# EAGLE design EAGLEPCBFINAL (EAGLE 9.6.2)
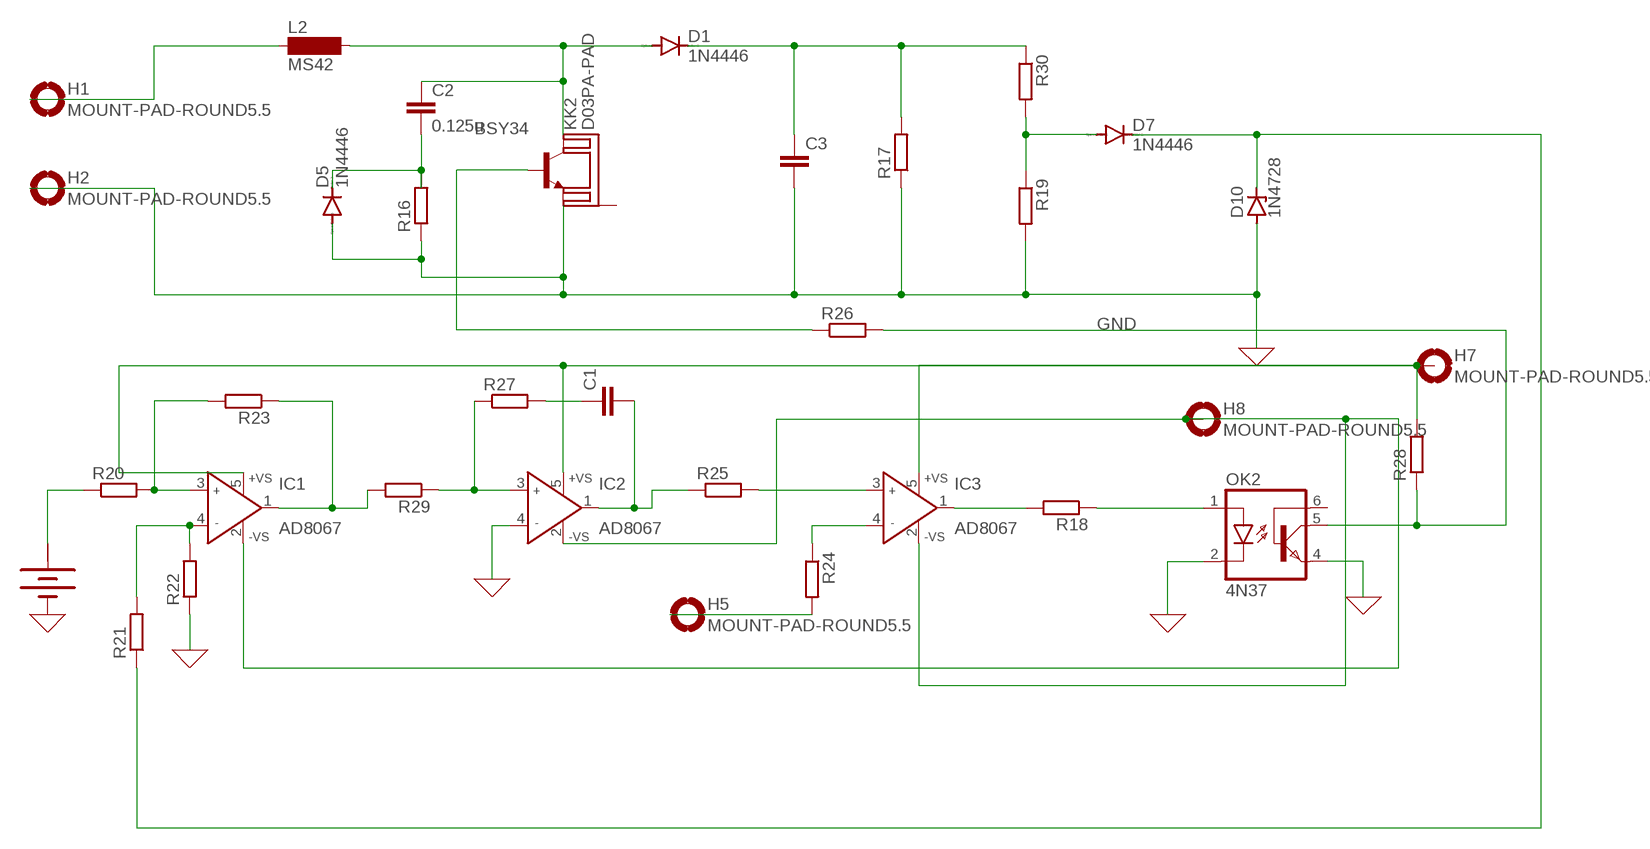
[diagram p0: schematic, sheet 1]

## Parts
BAT1  BATTERY  [BATTERY]
C1  C2.5/2  [C2.5-2]
C2  0.125u  C5/3.5  [C5B3.5]
C3  C7.5/3  [C7.5B3]
D1  1N4446  [DO35-10]
D5  1N4446  [DO35-10]
D7  1N4446  [DO35-10]
D10  1N4728  [DO41Z10]
H1  MOUNT-PAD-ROUND5.5  [5,5-PAD]
H2  MOUNT-PAD-ROUND5.5  [5,5-PAD]
H5  MOUNT-PAD-ROUND5.5  [5,5-PAD]
H7  MOUNT-PAD-ROUND5.5  [5,5-PAD]
H8  MOUNT-PAD-ROUND5.5  [5,5-PAD]
IC1  AD8067  [SOT23-5]
IC2  AD8067  [SOT23-5]
IC3  AD8067  [SOT23-5]
KK2  D03PA-PAD  [D03PA-PAD]
L2  MS42  [MS42]
OK2  4N37  [DIL06]
R16  R-EU_0204/2V  [0204V]
R17  R-EU_0204/2V  [0204V]
R18  R-EU_0204/5  [0204/5]
R19  R-EU_0207/10  [0207/10]
R20  R-EU_0207/10  [0207/10]
R21  R-EU_0207/10  [0207/10]
R22  R-EU_0207/10  [0207/10]
R23  R-EU_0207/10  [0207/10]
R24  R-EU_0207/10  [0207/10]
R25  R-EU_0207/10  [0207/10]
R26  R-EU_0207/10  [0207/10]
R27  R-EU_0309/12  [0309/12]
R28  R-EU_0411/15  [0411/15]
R29  R-EU_0411/15  [0411/15]
R30  R-EU_0922/22  [0922/22]
T1  BSY34  [TO39]

## Nets
0: BAT1.- C3.2 D5.A D10.A H2.B5,5(MOUNT) IC2.4(IN-) OK2.2(C) OK2.4(EMI) R16.1 R17.1 R19.2 R22.1 T1.1(E) ; supply symbol labelled GND
N$1: H1.B5,5(MOUNT) L2.1
N$2: C2.1 D1.A L2.2 T1.3(C)
N$3: C3.1 D1.C R17.2 R30.1
N$4: D7.A R19.1 R30.2
N$5: C2.2 D5.C R16.2
N$6: H8.B5,5(MOUNT) IC1.2(-VS) IC2.2(-VS) IC3.2(-VS)
N$7: D7.C D10.C R21.1
N$8: BAT1.+ R20.1
N$9: IC1.3(IN+) R20.2 R23.2
N$10: IC1.4(IN-) R21.2 R22.2
N$11: IC1.1(OUT) R23.1 R29.2
N$12: IC2.3(IN+) R27.1 R29.1
N$13: C1.1 R27.2
N$14: C1.2 IC2.1(OUT) R25.1
N$15: IC3.3(IN+) R25.2
N$16: IC3.4(IN-) R24.1
N$17: IC3.1(OUT) R18.2
N$18: OK2.1(A) R18.1
N$19: OK2.5(COL) R26.2 R28.1
N$20: H7.B5,5(MOUNT) IC1.5(+VS) IC2.5(+VS) IC3.5(+VS) R28.2
N$21: R26.1 T1.2(B)
N$23: H5.B5,5(MOUNT) R24.2
Unconnected: KK2.B(K) OK2.6(BAS)

## Notes on the sheet
- GND

## Power pins joined to a net without a drawn wire
+: BAT1.+@1(+)

## Library data of the parts
BAT1 = special:BATTERY: BATTERY
C1-C3 = capacitor-wima:C: CAPACITOR naming: grid - package width
D1 D5 D7 = diode:1N4446: DIODE high speed (Philips)
D10 = diode:1N4728: Z DIODE 3.3 V, 1W, 5 percent
H1 H2 H5 H7 H8 = holes:MOUNT-PAD-ROUND: MOUNTING PAD, round
IC1-IC3 = analog-devices:AD8067: High Gain Bandwidth, Precision Fast FET(TM) Op Amp Source: http://www.analog.com/UploadedFiles/Data_Sheets/346131962AD8067_a.pdf; MF: ALTERA CORPORATION; MPN: AD8067ARTZ-REEL7; OC_FARNELL: 1464848; OC_NEWARK: 59K6326
KK2 = heatsink:D03PA-PAD: HEATSINK distributor Schukat
L2 = inductor-neosid:MS42: INDUCTOR SMD inductor; OC_FARNELL: unknown; OC_NEWARK: unknown
OK2 = optocoupler:4N37: OPTO COUPLER Source: http://www.fairchildsemi.com/pf/4N/4N35-M.html; MF: FAIRCHILD SEMICONDUCTOR; MPN: 4N37; OC_FARNELL: 1612456; OC_NEWARK: 72K9948
R16-R30 = rcl:R-EU_: RESISTOR, European symbol; SPICEPREFIX: R
T1 = transistor:BSY34: NPN TRANSISTOR

## Board
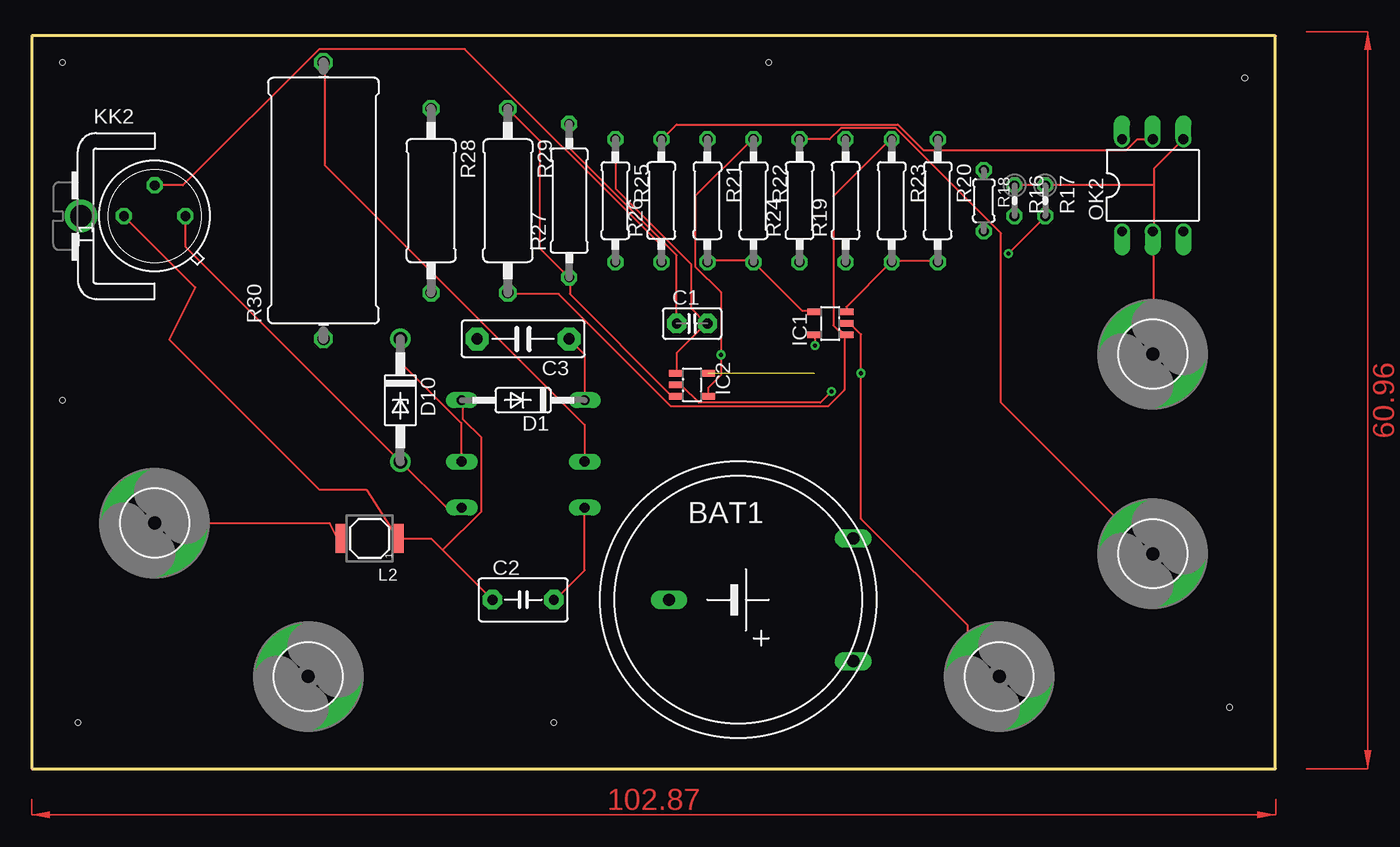
[diagram p1: board, top side]
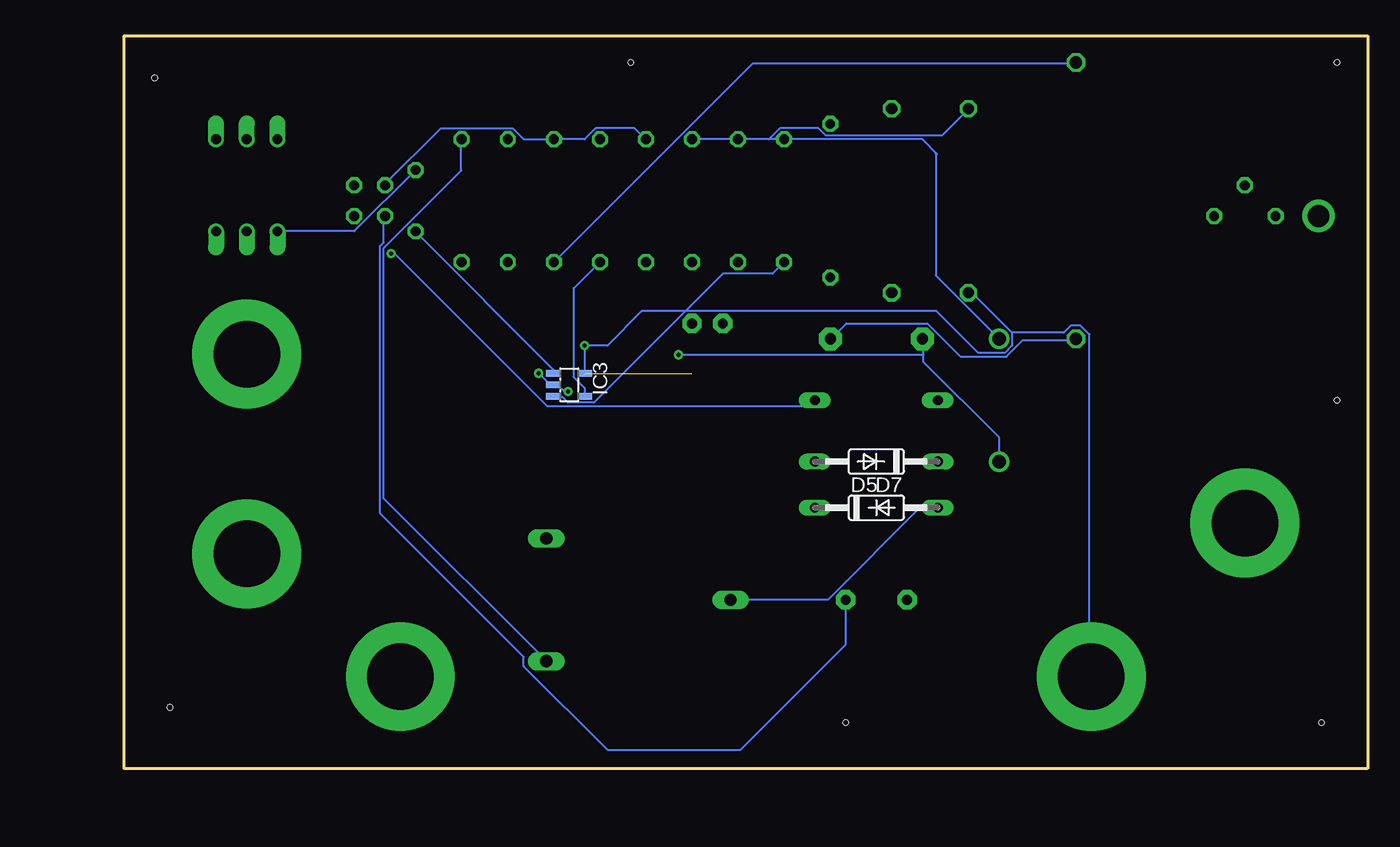
[diagram p2: board, bottom side, seen from below]

Size 102.85 x 60.63 mm. Coordinates in mm from the lower left corner, seen from the top.
Outline: 0,0 102.85,0 102.85,60.63 0,60.63 0,0
Copper layers (1*16): Top 0.035mm / dielectric 1.5mm / Bottom 0.035mm
Design rules "default": minimum track width 6mil, minimum drill 0.35mm, track to track 6mil, track to pad 6mil, pad to pad 6mil, via to via 6mil, smd to smd 6mil, copper to edge 40mil, drill to drill 6mil, minimum pad ring 10mil, minimum via ring 8mil, stop-mask expansion 4mil, vias tented up to drill 0mil, thermal gap 10mil
Holes 0.46 mm at 2.54,58.42 3.81,3.81 43.18,3.81 99.06,5.08 60.96,58.42 100.33,57.15 2.54,30.48

### Footprints (pad centres in the part's own frame; a part is rotated, then mirrored left to right if it is on the bottom)
BATTERY = drill 1.016 long: + 9.525,-5.08; +@1 9.525,5.08; - -5.715,0
C2.5-2 = drill 0.813 pad 1.6 octagon: 1 -1.27,0; 2 1.27,0
C5B3.5 = drill 0.813 pad 1.6 octagon: 1 -2.54,0; 2 2.54,0
C7.5B3 = drill 0.914 pad 1.905 octagon: 1 -3.81,0; 2 3.81,0
DO35-10 = drill 0.813 long: A 5.08,0; C -5.08,0
DO41Z10 = drill 1.118: A 5.08,0; C -5.08,0
5,5-PAD = drill 5.5 pad 9: B5,5 0,0
SOT23-5 = smd 0.55 x 1.2: 1 -0.95,-1.3; 2 0,-1.3; 3 0.95,-1.3; 4 0.95,1.3; 5 -0.95,1.3
D03PA-PAD = drill 1.803 pad 2.54: B 0,-1.016
MS42 = smd 2.4 x 1: 1 0,2.3; 2 0,-2.3
DIL06 = drill 0.813 offset: 1 -2.54,-3.81; 2 0,-3.81; 3 2.54,-3.81; 4 2.54,3.81; 5 0,3.81; 6 -2.54,3.81
0204V = drill 0.813 octagon: 1 -1.27,0; 2 1.27,0
0204/5 = drill 0.813 octagon: 1 -2.54,0; 2 2.54,0
0207/10 = drill 0.813 octagon: 1 -5.08,0; 2 5.08,0
0309/12 = drill 0.813 octagon: 1 -6.35,0; 2 6.35,0
0411/15 = drill 0.914 octagon: 1 -7.62,0; 2 7.62,0
0922/22 = drill 1.016 octagon: 1 -11.43,0; 2 11.43,0
TO39 = drill 0.813 octagon: 1 0,-2.54; 2 2.54,0; 3 0,2.54

### Placement (x,y rotation side)
BAT1  58.42,13.97 0 top
C1  54.61,36.83 0 top
C2  40.64,13.97 0 top
C3  40.64,35.56 180 top
D1  40.64,30.48 180 top
D5  40.64,21.59 0 bottom
D7  40.64,25.4 180 bottom
D10  30.48,30.48 270 top
H1  10.16,20.32 0 top
H2  92.71,34.29 0 top
H5  92.71,17.78 0 top
H7  22.86,7.62 0 top
H8  80.01,7.62 0 top
IC1  66.04,36.83 90 top
IC2  54.61,31.75 270 top
IC3  66.04,31.75 270 bottom
KK2  5.08,45.72 270 top
L2  27.94,19.05 90 top
OK2  92.71,48.26 0 top
R16  81.28,46.99 270 top
R17  83.82,46.99 270 top
R18  78.74,46.99 270 top
R19  67.31,46.99 90 top
R20  74.93,46.99 270 top
R21  55.88,46.99 270 top
R22  59.69,46.99 270 top
R23  71.12,46.99 270 top
R24  63.5,46.99 90 top
R25  48.26,46.99 270 top
R26  52.07,46.99 90 top
R27  44.45,46.99 90 top
R28  33.02,46.99 270 top
R29  39.37,46.99 270 top
R30  24.13,46.99 90 top
T1  10.16,45.72 90 top

### Tracks (layer width: path | path; a pad name or v marks a point on that pad's centre or on a via)
0  (via drill 0.35)
  Top 0.152: D5.A 34.29,21.59 D10.A 12.7,43.18 T1.1 | IC2.4 55.93,30.89 55.93,31.5 57,32.56 v57,34.24 57,39.42 54.86,41.55 54.86,47.35 59.59,52.07 R22.1 | R16.1 R17.1 92.81,48.26 | 92.81,48.26 92.81,49.63 OK2.4 | 92.81,48.26 92.81,44.45 | 92.81,44.45 92.81,34.39 H2.B5,5 | 92.81,44.45 OK2.2
  Bottom 0.152: BAT1.- 44.65,13.97 37.03,21.59 D5.A | 36.73,34.24 36.73,33.63 30.48,27.38 D10.A | 36.73,34.24 36.73,35.46 C3.2 | R22.1 59.74,52.07 60.65,52.98 63.86,52.98 64.77,52.07 R19.2 69.8,52.07 70.71,52.98 76.66,52.98 81.38,48.26 R16.1 | v57,34.24 36.73,34.24
N$1
  Top 0.152: L2.1 25.6,19 25.3,19 24.64,20.32 H1.B5,5
N$2
  Top 0.152: C2.1 33.98,18.09 | 33.98,18.09 33.07,19 30.33,19 L2.2 27.68,23.06 23.83,23.06 11.38,35.51 13.53,39.81 T1.3 | 33.98,18.09 37.19,21.29 37.19,27.38 35.66,28.91 35.66,30.43 D1.A
N$3  (via drill 0.35)
  Top 0.152: D1.C 45.72,34.24 44.5,35.46 C3.1 | v80.77,42.62 83.82,45.67 R17.2
  Bottom 0.152: v80.77,42.62 80.47,42.62 67.82,29.97 46.18,29.97 45.72,30.43 D1.C | R30.1 24.23,35.46 28.5,35.46 29.87,34.09 33.68,34.09 36.42,36.83 43.13,36.83 44.35,35.61 C3.1
N$4
  Top 0.152: D7.A 45.72,28.45 24.23,49.94 24.23,58.32 R30.2
  Bottom 0.152: R19.1 50.9,58.32 24.23,58.32 R30.2
N$5
  Top 0.152: D5.C 45.72,16.41 43.28,13.97 C2.2
  Bottom 0.152: C2.2 43.18,10.26 51.92,1.52 62.84,1.52 69.8,8.48 69.8,9.25 81.69,21.13 81.69,43.23 81.38,43.54 81.38,45.67 R16.2
N$6  (via drill 0.35)
  Top 0.152: v66.14,31.19 65.23,30.28 55.17,30.28 53.8,31.65 53.34,31.65 IC2.2 | IC1.2 67.67,36.83 68.58,35.92 v68.58,32.71 68.58,20.68 77.42,11.84 77.42,7.62 H8.B5,5
  Bottom 0.152: v66.14,31.19 66.45,31.19 66.9,31.65 67.21,31.65 IC3.2 67.36,31.8 67.67,31.8 v68.58,32.71
N$7
  Top 0.152: D10.C 30.48,33.63 35.51,28.6 35.51,25.4 D7.C
  Bottom 0.152: R21.1 36.83,52.07 35.61,50.85 35.71,50.85 35.71,40.79 D10.C
N$8
  Bottom 0.152: R20.1 74.98,52.07 74.98,49.48 81.38,43.08 81.38,22.35 67.97,8.94 BAT1.+
N$9
  Top 0.152: IC1.3 67.36,37.9 67.36,38.2 71.02,41.86 R23.2 71.17,42.01 74.83,42.01 R20.2
N$10
  Top 0.152: IC1.4 64.62,37.9 63.7,37.9 R22.2 59.59,42.01 55.93,42.01 R21.2
N$11
  Top 0.152: R23.1 71.02,52.07 66.29,47.35 66.29,36.68 66.75,36.22 66.9,36.22 67.21,35.92 IC1.1 67.21,35.76 67.21,31.34 65.84,29.97 52.88,29.97 43.59,39.27 39.47,39.27 R29.2
N$12
  Top 0.152: IC2.3 53.19,30.89 52.88,30.89 44.5,39.27 44.5,40.64 R27.1 42.01,43.08 42.01,51.97 R29.1
N$13
  Top 0.152: C1.1 53.34,42.47 44.5,51.31 44.5,53.29 R27.2
N$14
  Top 0.152: 55.78,36.83 53.34,34.39 53.34,32.71 IC2.1 | 55.78,36.83 54.56,38.05 54.56,41.71 48.31,47.96 48.31,52.07 R25.1 | 55.78,36.83 C1.2
N$15
  Bottom 0.152: R25.2 49.23,40.95 53.34,40.95 64.01,30.28 66.14,30.28 66.6,30.73 67.21,30.73 IC3.3
N$16
  Bottom 0.152: R24.1 65.68,39.73 65.68,32.41 64.77,31.5 64.77,30.89 IC3.4
N$17
  Bottom 0.152: IC3.1 67.36,32.71 67.36,33.02 78.79,44.45 R18.2
N$18
  Bottom 0.152: OK2.1 83.82,44.45 R18.1
N$19
  Top 0.152: OK2.5 91.44,52.07 90.53,51.16 73.76,51.16 71.63,53.29 53.34,53.29 52.12,52.07 R26.2
  Bottom 0.152: R26.2 49.53,52.07 48.62,52.98 45.41,52.98 44.81,52.38 35.2,52.38 33.07,54.51 R28.1
N$20  (via drill 0.35)  (1 unrouted)
  Top 0.152: v64.77,35 64.77,35.76 IC1.5
  Bottom 0.152: IC3.5 64.77,32.71 v64.77,35 62.89,35 60.05,37.85 35.66,37.85 32.21,34.39 30.02,34.39 29.41,35 29.41,36.07 | 29.41,36.07 32.61,39.27 32.92,39.27 R28.2 | 29.41,36.07 25.15,36.07 24.54,36.68 23.77,36.68 23.01,35.92 23.01,7.77 H7.B5,5
N$21
  Top 0.152: T1.2 12.5,48.26 23.77,59.54 35.81,59.54 51.97,43.38 51.97,42.01 R26.1
N$23
  Top 0.152: R24.2 65.99,52.07 66.9,52.98 71.48,52.98 80.16,44.3 80.16,30.28 92.66,17.78 H5.B5,5
(copper drawn outside any net)
  shapes: Top area x2